# Altium schematic sheet TOF_GND_SCHEME.SchDoc: TOF GND Scheme
size OrCAD B; SheetNumber: 1; SheetTotal: 32
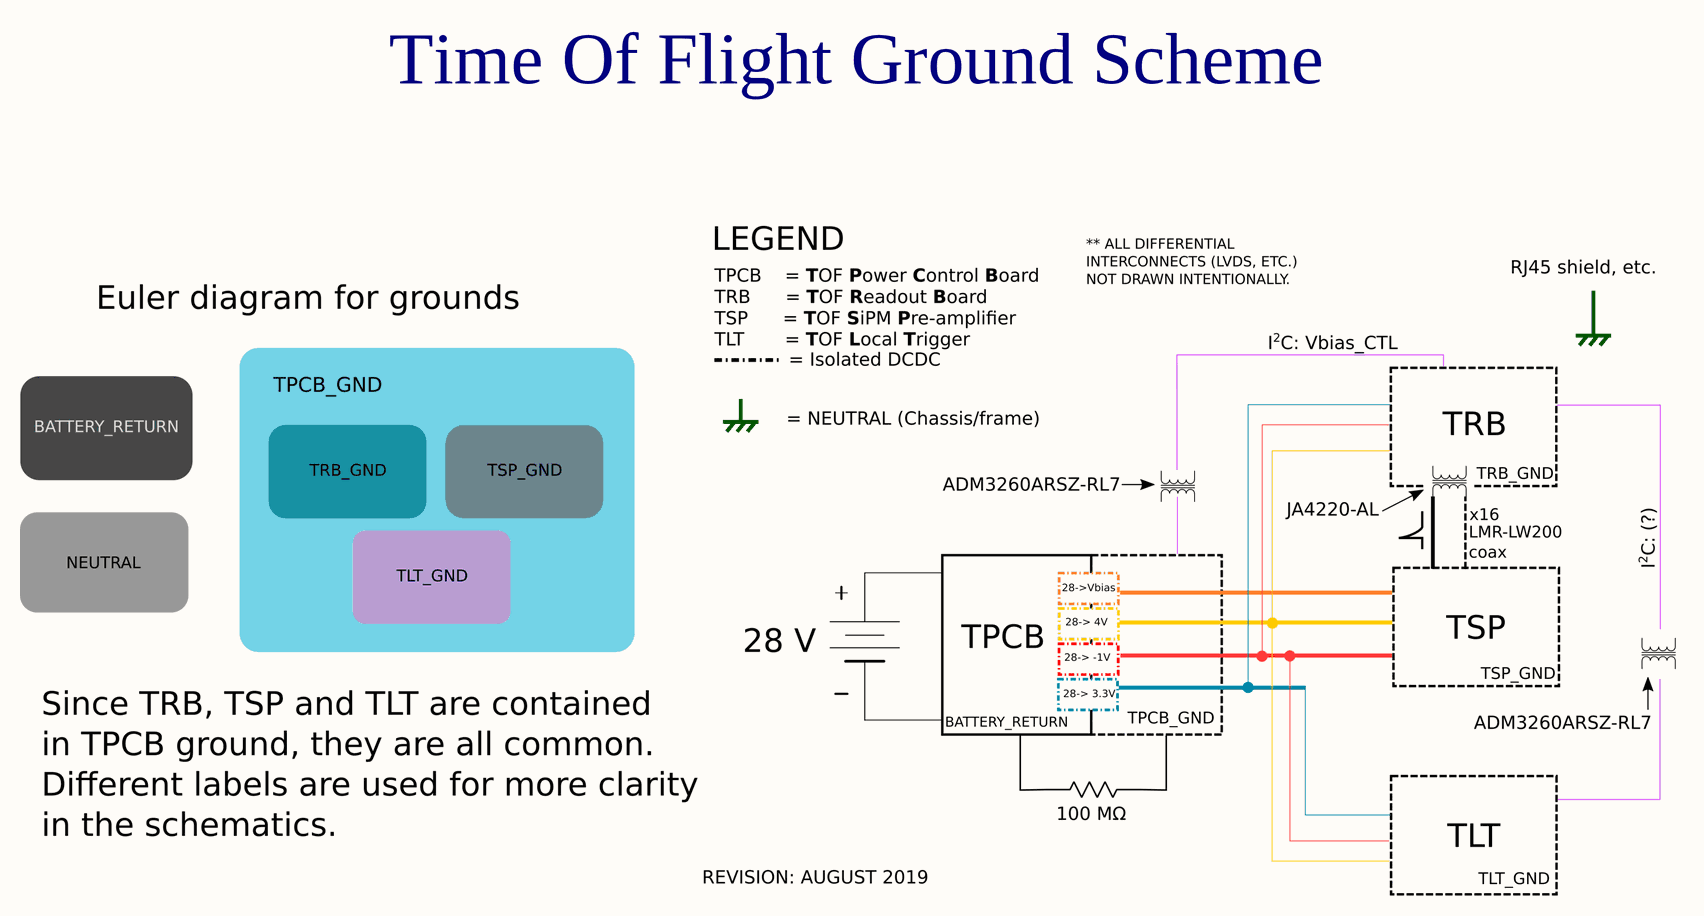
[diagram p0: TOF_GND_SCHEME.SchDoc]

## Notes on the sheet
- Time Of Flight Ground Scheme
- 475 Portola Plaza
- GAPS TOF
- Title
- igarcia91@g.ucla.edu
- Los Angeles, CA
- 310-825-0344
- Size:
- Date:
- Letter
- Number:
- Time:
- Sheet
- Revision:
- of
- andrew.peck@cern.ch
- spq@ucla.edu
- File: